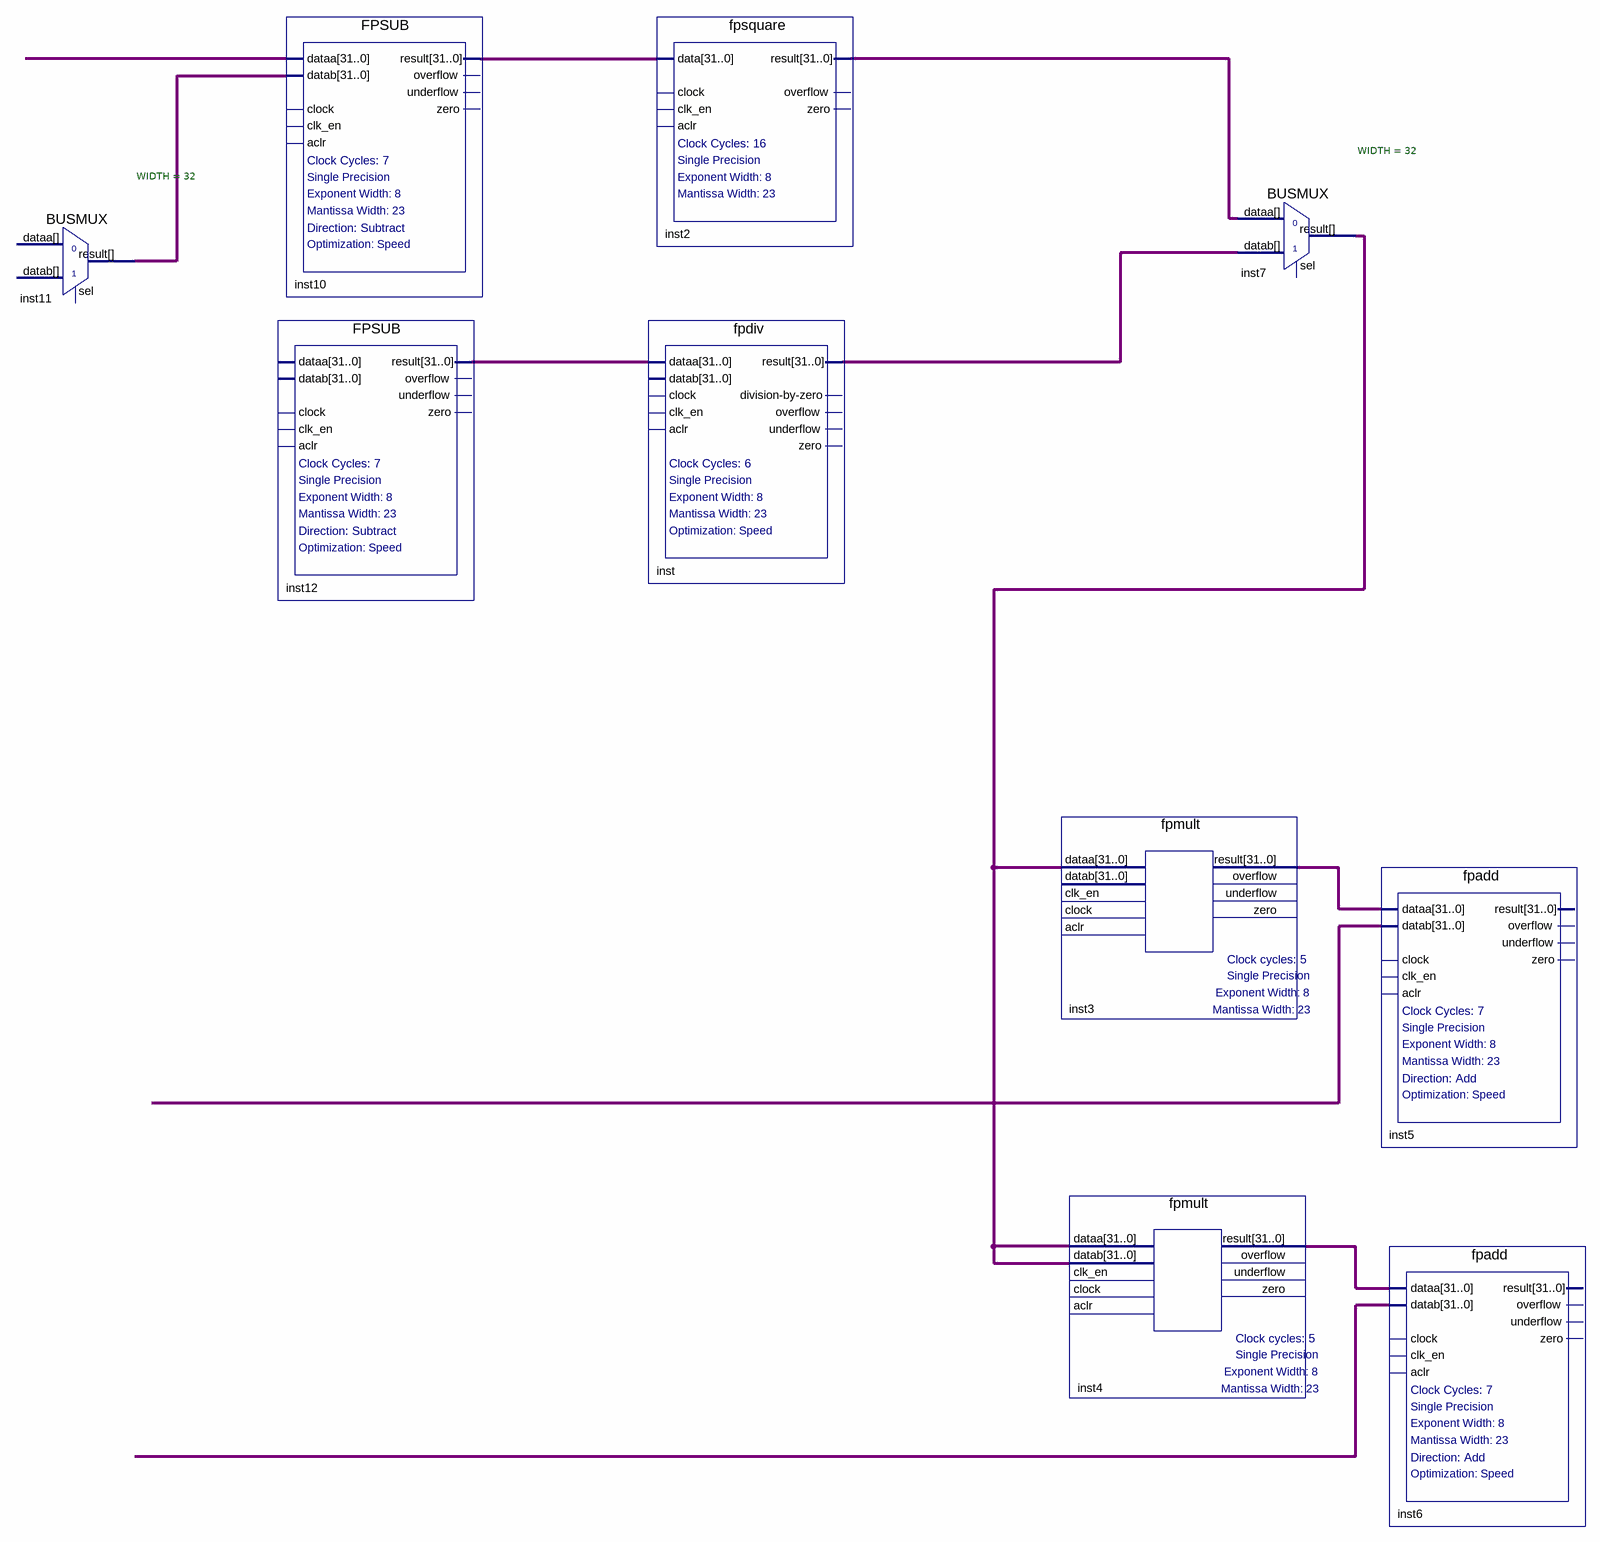
[diagram p0: schematic sheet]
// Quartus schematic basic_ukf.bdf as structural Verilog: 10 symbols, 0 pins
module basic_ukf (
);

  wire [31:0] inst2_result, inst3_result, inst4_result, inst7_result, inst10_result, inst11_result,
       inst12_result, inst_result, undriven, undriven_2, undriven_3;

  BUSMUX #(.WIDTH(32)) inst11 (.result(inst11_result));  // open: datab, sel, dataa
  FPSUB inst10 (
    .dataa(undriven_3), .datab(inst11_result), .result(inst10_result));  // open: clock, clk_en, aclr, overflow, underflow, zero
  FPSUB inst12 (.result(inst12_result));  // open: dataa, datab, clock, clk_en, aclr, overflow, underflow, zero
  fpsquare inst2 (.data(inst10_result), .result(inst2_result));  // open: clock, clk_en, aclr, overflow, zero
  fpdiv inst (
    .dataa(inst12_result), .result(inst_result));  // open: datab, clock, clk_en, aclr, division-by-zero, overflow, underflow, zero
  fpmult inst3 (
    .dataa(inst7_result), .result(inst3_result));  // open: datab, clk_en, clock, aclr, overflow, underflow, zero
  fpmult inst4 (
    .dataa(inst7_result), .datab(inst7_result), .result(inst4_result));  // open: clk_en, clock, aclr, overflow, underflow, zero
  BUSMUX #(.WIDTH(32)) inst7 (.datab(inst_result), .dataa(inst2_result), .result(inst7_result));  // open: sel
  fpadd inst5 (.dataa(inst3_result), .datab(undriven));  // open: clock, clk_en, aclr, result, overflow, underflow, zero
  fpadd inst6 (
    .dataa(inst4_result), .datab(undriven_2));  // open: clock, clk_en, aclr, result, overflow, underflow, zero
endmodule
